# Altium schematic sheet Voltage Regulators old.SchDoc
size E
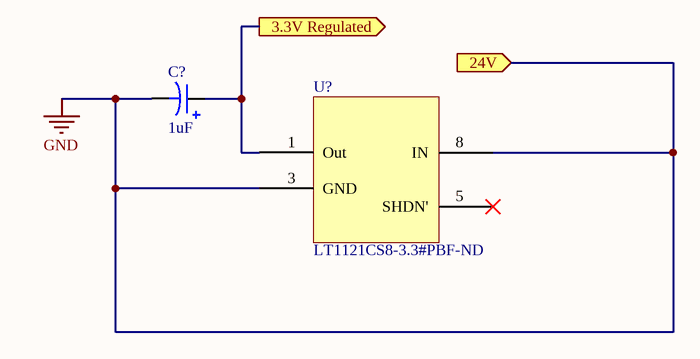
[diagram p0: Voltage Regulators old.SchDoc]

## Parts
C?  1uF  [Radial_6.3mmDia_SM_D]
U?  LT1121CS8-3.3#PBF-ND  [SOT230P700X180-4N]

## Ports
3.3V Regulated (out), 24V (in)

## Nets
GND: C?.N U?.3(GND) U?.8(IN) ; port 24V
3.3V Regulated: C?.P U?.1(Out) ; port 3.3V Regulated

Not connected (* = marked no-connect by the designer): U? 5(SHDN')*

## Library data of the parts
C? = Capacitor (polarized)
U? = LT1121CS8-3.3#PBF-ND: 3.3V Micropower Low Dropout Regulator with Shutdown